# EAGLE design punch driver Rev A (EAGLE 6.6.0)

## Sheet 1 of 6
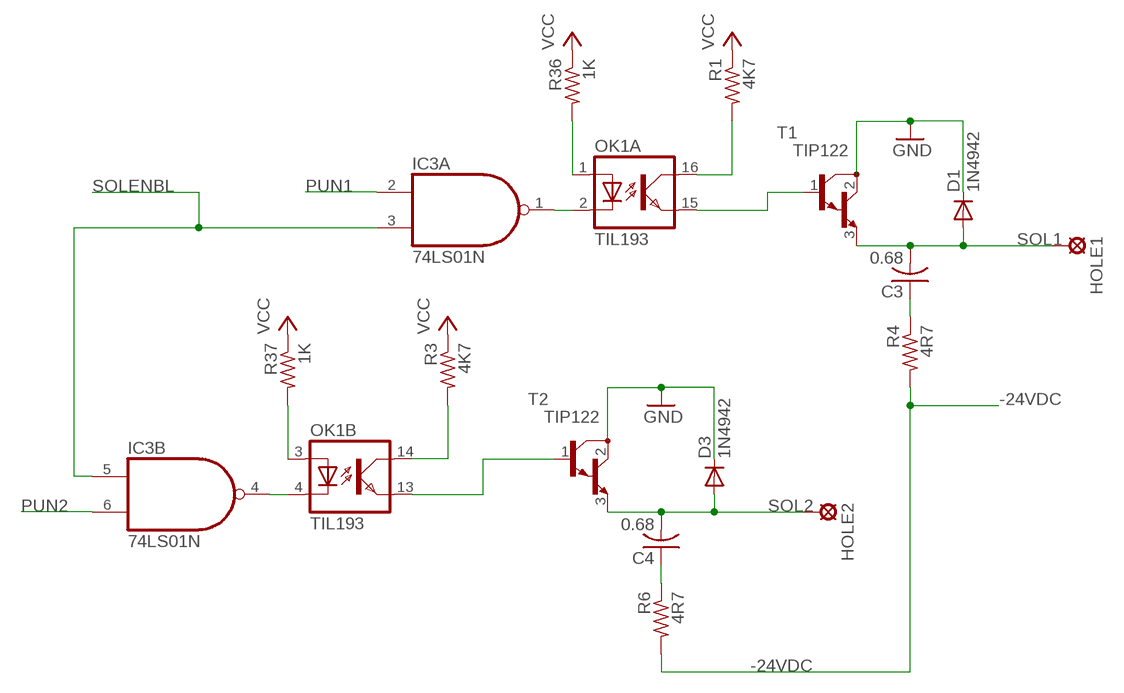
[diagram p0: schematic, sheet 1]

### Parts
C3  0.68  C-US075-042X103  [C075-042X103]
C4  0.68  C-US075-042X103  [C075-042X103]
D1  1N4942  [DO41-10]
D3  1N4942  [DO41-10]
HOLE1  SE13  [SE13]
HOLE2  SE13  [SE13]
IC3  74LS01N  [DIL14]
OK1  TIL193  [DIL16]
R1  4K7  R-US_0204/5  [0204/5]
R3  4K7  R-US_0204/5  [0204/5]
R4  4R7  R-US_0207/10  [0207/10]
R6  4R7  R-US_0207/10  [0207/10]
R36  1K  R-US_0204/5  [0204/5]
R37  1K  R-US_0204/5  [0204/5]
T1  TIP122  [TO220]
T2  TIP122  [TO220]

### Nets
-24VDC [power]: R4.2 R6.2 ; also sheet 2,3,4,5
GND [GND]: D1.C D3.C T1.2(C) T2.2(C) ; also sheet 2,3,4,5
N$3: OK1.15(A:EMIT) T1.1(B)
N$4: OK1.14(B:COL) R3.2
N$15 [power]: C3.1 R4.1
N$18 [power]: C4.1 R6.1
N$27: IC3.1(A:O) OK1.2(A:C)
N$28: IC3.4(B:O) OK1.4(B:C)
N$29: OK1.1(A:A) R36.2
N$30: OK1.3(B:A) R37.2
N$38: OK1.16(A:COL) R1.2
N$48: OK1.13(B:EMIT) T2.1(B)
PUN1: IC3.2(A:I0) ; also sheet 6
PUN2: IC3.6(B:I1) ; also sheet 6
SOL1 [power]: C3.2 D1.A HOLE1.MP T1.3(E)
SOL2 [power]: C4.2 D3.A HOLE2.MP T2.3(E)
SOLENBL: IC3.3(A:I1) IC3.5(B:I0) ; also sheet 2,3,4,5
VCC [power]: R1.1 R3.1 R36.1 R37.1 ; also sheet 2,3,4,5,6

## Sheet 2 of 6
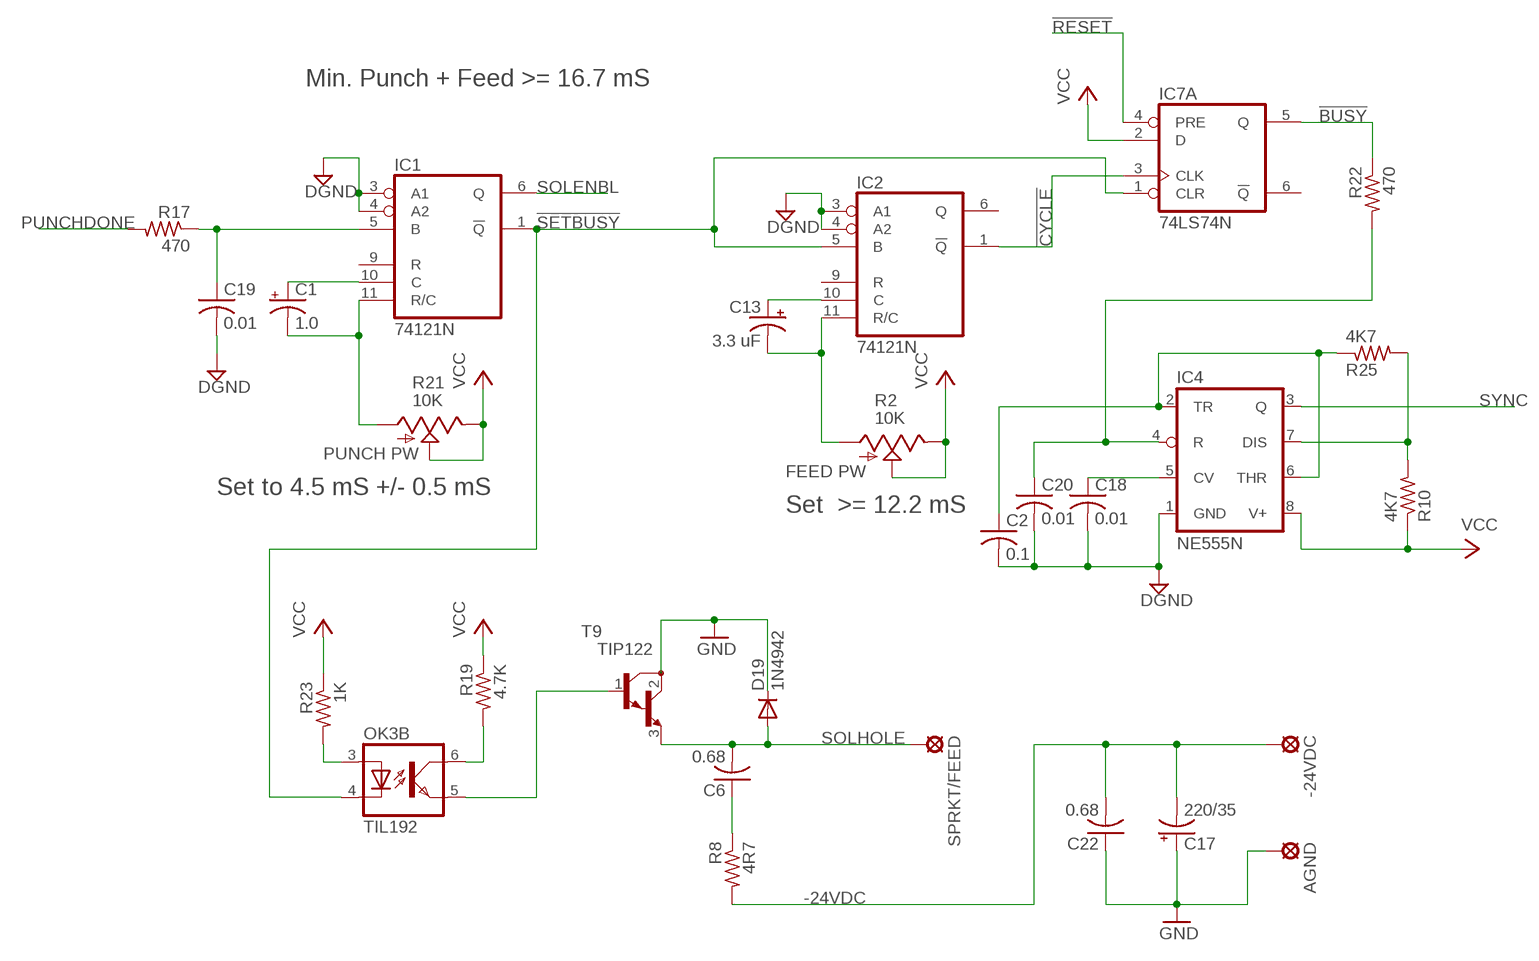
[diagram p1: schematic, sheet 2]

### Parts
-24VDC  SE13  [SE13]
AGND  SE13  [SE13]
C1  1.0  CPOL-USE5-10.5  [E5-10,5]
C2  0.1  C-US050-025X075  [C050-025X075]
C6  0.68  C-US075-042X103  [C075-042X103]
C13  3.3 uF  CPOL-USE5-10.5  [E5-10,5]
C17  220/35  CPOL-USE25-9AXIAL  [E25-9]
C18  0.01  C-US025-025X050  [C025-025X050]
C19  0.01  C-US025-025X050  [C025-025X050]
C20  0.01  C-US025-025X050  [C025-025X050]
C22  0.68  C-US075-042X103  [C075-042X103]
D19  1N4942  [DO41-10]
IC1  74121N  [DIL14]
IC2  74121N  [DIL14]
IC4  NE555N  [DIL08]
IC7  74LS74N  [DIL14]
OK3  TIL192  [DIL08]
R2  10K  TRIM_US-PTSPIN  [PT-SPIN]
R8  4R7  R-US_0207/10  [0207/10]
R10  4K7  R-US_0204/5  [0204/5]
R17  470  R-US_0204/5  [0204/5]
R19  4.7K  R-US_0204/5  [0204/5]
R21  10K  TRIM_US-PTSPIN  [PT-SPIN]
R22  470  R-US_0204/5  [0204/5]
R23  1K  R-US_0204/5  [0204/5]
R25  4K7  R-US_0204/5  [0204/5]
SPRKT/FEED  SE13  [SE13]
T9  TIP122  [TO220]

### Nets
!BUSY: IC7.5(A:Q) R22.1
!CYCLE: IC2.1(!Q) IC7.3(A:CLK)
!RESET: IC7.4(A:PRE) ; also sheet 6
!SETBUSY: IC1.1(!Q) IC2.5(B) IC7.1(A:CLR) OK3.4(B:C)
-24VDC [power]: -24VDC.MP C17.- C22.2 R8.2 ; also sheet 1,3,4,5
DGND [power]: C2.2 C18.2 C19.2 C20.2 IC1.3(A1) IC1.4(A2) IC2.3(A1) IC2.4(A2) IC4.1(GND) ; also sheet 6
GND [GND]: AGND.MP C17.+ C22.1 D19.C T9.2(C) ; also sheet 1,3,4,5
N$1: C1.+ IC1.10(C)
N$9: IC4.7(DIS) R10.2 R25.2
N$10: OK3.6(B:COL) R19.2
N$13: C19.1 IC1.5(B) R17.1
N$14: OK3.3(B:A) R23.2
N$16: C1.- IC1.11(R/C) R21.A
N$17: C2.1 IC4.2(TR) IC4.6(THR) R25.1
N$19: C20.1 IC4.4(R) R22.2
N$20 [power]: C6.1 R8.1
N$31: C13.+ IC2.10(C)
N$32: C13.- IC2.11(R/C) R2.A
N$49 [power]: OK3.5(B:EMIT) T9.1(B)
N$58: C18.1 IC4.5(CV)
PUNCHDONE: R17.2 ; also sheet 6
SOLENBL: IC1.6(Q) ; also sheet 1,3,4,5
SOLHOLE [power]: C6.2 D19.A SPRKT/FEED.MP T9.3(E)
SYNC: IC4.3(Q) ; also sheet 6
VCC [power]: IC4.8(V+) IC7.2(A:D) R2.E R2.S R10.1 R19.1 R21.E R21.S R23.1 ; also sheet 1,3,4,5,6
Unconnected: IC1.9(R) IC2.6(Q) IC2.9(R) IC7.6(A:!Q) OK3.1(A:A) OK3.2(A:C) OK3.7(A:EMIT) OK3.8(A:COL)

### Notes on the sheet
- Min. Punch + Feed >= 16.7 mS
- PUNCH PW
- FEED PW
- Set to 4.5 mS +/- 0.5 mS
- Set  >= 12.2 mS

## Sheet 3 of 6
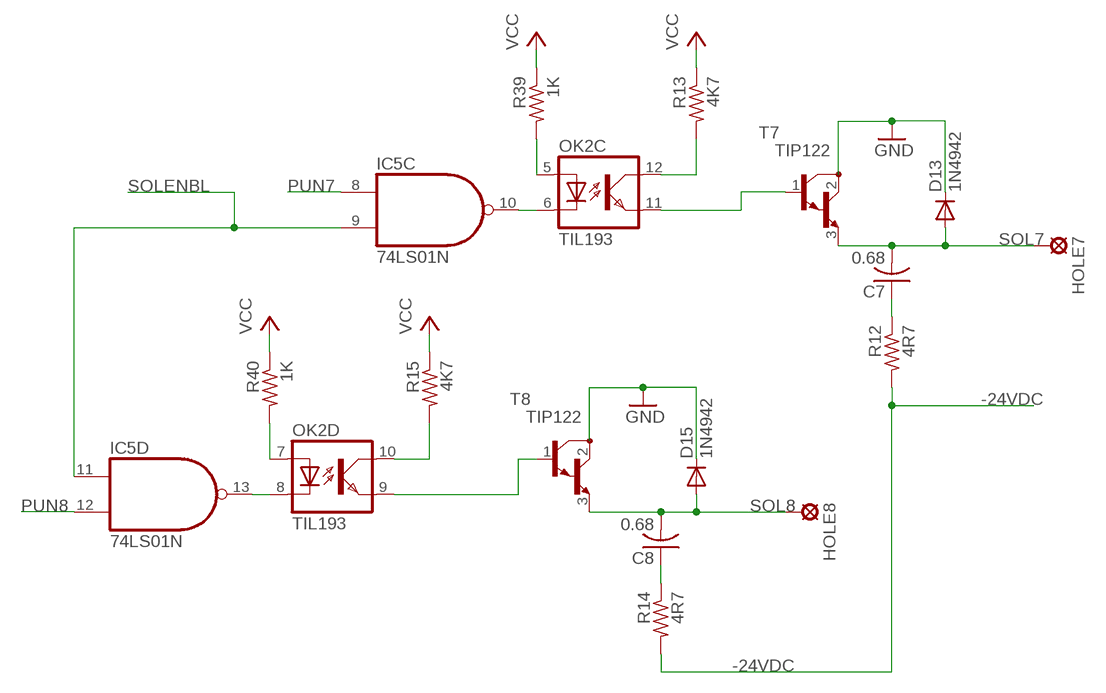
[diagram p2: schematic, sheet 3]

### Parts
C7  0.68  C-US075-042X103  [C075-042X103]
C8  0.68  C-US075-042X103  [C075-042X103]
D13  1N4942  [DO41-10]
D15  1N4942  [DO41-10]
HOLE7  SE13  [SE13]
HOLE8  SE13  [SE13]
IC5  74LS01N  [DIL14]
OK2  TIL193  [DIL16]
R12  4R7  R-US_0207/10  [0207/10]
R13  4K7  R-US_0204/5  [0204/5]
R14  4R7  R-US_0207/10  [0207/10]
R15  4K7  R-US_0204/5  [0204/5]
R39  1K  R-US_0204/5  [0204/5]
R40  1K  R-US_0204/5  [0204/5]
T7  TIP122  [TO220]
T8  TIP122  [TO220]

### Nets
-24VDC [power]: R12.2 R14.2 ; also sheet 1,2,4,5
GND [GND]: D13.C D15.C T7.2(C) T8.2(C) ; also sheet 1,2,4,5
N$11: OK2.12(C:COL) R13.2
N$12: OK2.10(D:COL) R15.2
N$21 [power]: C7.1 R12.1
N$22 [power]: C8.1 R14.1
N$40: IC5.13(D:O) OK2.8(D:C)
N$41: IC5.10(C:O) OK2.6(C:C)
N$42: OK2.7(D:A) R40.2
N$43: OK2.5(C:A) R39.2
N$51: OK2.11(C:EMIT) T7.1(B)
N$52: OK2.9(D:EMIT) T8.1(B)
PUN7: IC5.8(C:I0) ; also sheet 6
PUN8: IC5.12(D:I1) ; also sheet 6
SOL7 [power]: C7.2 D13.A HOLE7.MP T7.3(E)
SOL8 [power]: C8.2 D15.A HOLE8.MP T8.3(E)
SOLENBL: IC5.9(C:I1) IC5.11(D:I0) ; also sheet 1,2,4,5
VCC [power]: R13.1 R15.1 R39.1 R40.1 ; also sheet 1,2,4,5,6

## Sheet 4 of 6
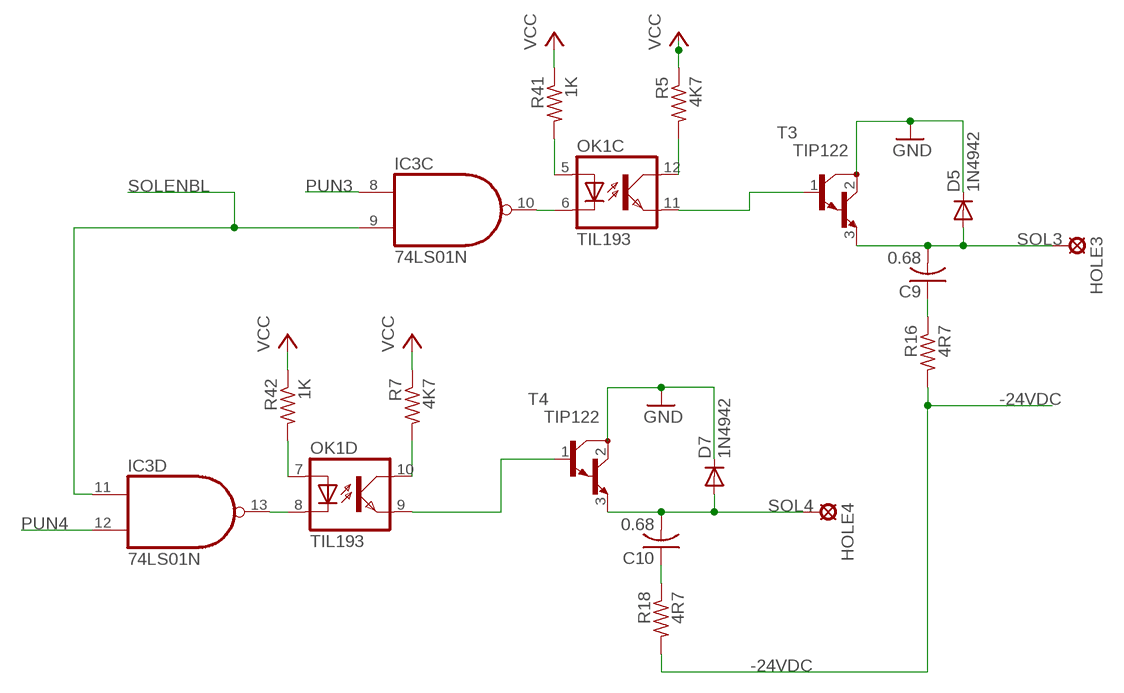
[diagram p3: schematic, sheet 4]

### Parts
C9  0.68  C-US075-042X103  [C075-042X103]
C10  0.68  C-US075-042X103  [C075-042X103]
D5  1N4942  [DO41-10]
D7  1N4942  [DO41-10]
HOLE3  SE13  [SE13]
HOLE4  SE13  [SE13]
R5  4K7  R-US_0204/5  [0204/5]
R7  4K7  R-US_0204/5  [0204/5]
R16  4R7  R-US_0207/10  [0207/10]
R18  4R7  R-US_0207/10  [0207/10]
R41  1K  R-US_0204/5  [0204/5]
R42  1K  R-US_0204/5  [0204/5]
T3  TIP122  [TO220]
T4  TIP122  [TO220]

### Nets
-24VDC [power]: R16.2 R18.2 ; also sheet 1,2,3,5
GND [GND]: D5.C D7.C T3.2(C) T4.2(C) ; also sheet 1,2,3,5
N$5: OK1.12(C:COL) R5.2
N$8: OK1.10(D:COL) R7.2
N$23 [power]: C9.1 R16.1
N$24 [power]: C10.1 R18.1
N$35: IC3.10(C:O) OK1.6(C:C)
N$36: IC3.13(D:O) OK1.8(D:C)
N$44: OK1.7(D:A) R42.2
N$45: OK1.5(C:A) R41.2
N$53: OK1.9(D:EMIT) T4.1(B)
N$54: OK1.11(C:EMIT) T3.1(B)
PUN3: IC3.8(C:I0) ; also sheet 6
PUN4: IC3.12(D:I1) ; also sheet 6
SOL3 [power]: C9.2 D5.A HOLE3.MP T3.3(E)
SOL4 [power]: C10.2 D7.A HOLE4.MP T4.3(E)
SOLENBL: IC3.9(C:I1) IC3.11(D:I0) ; also sheet 1,2,3,5
VCC [power]: R5.1 R7.1 R41.1 R42.1 ; also sheet 1,2,3,5,6

## Sheet 5 of 6
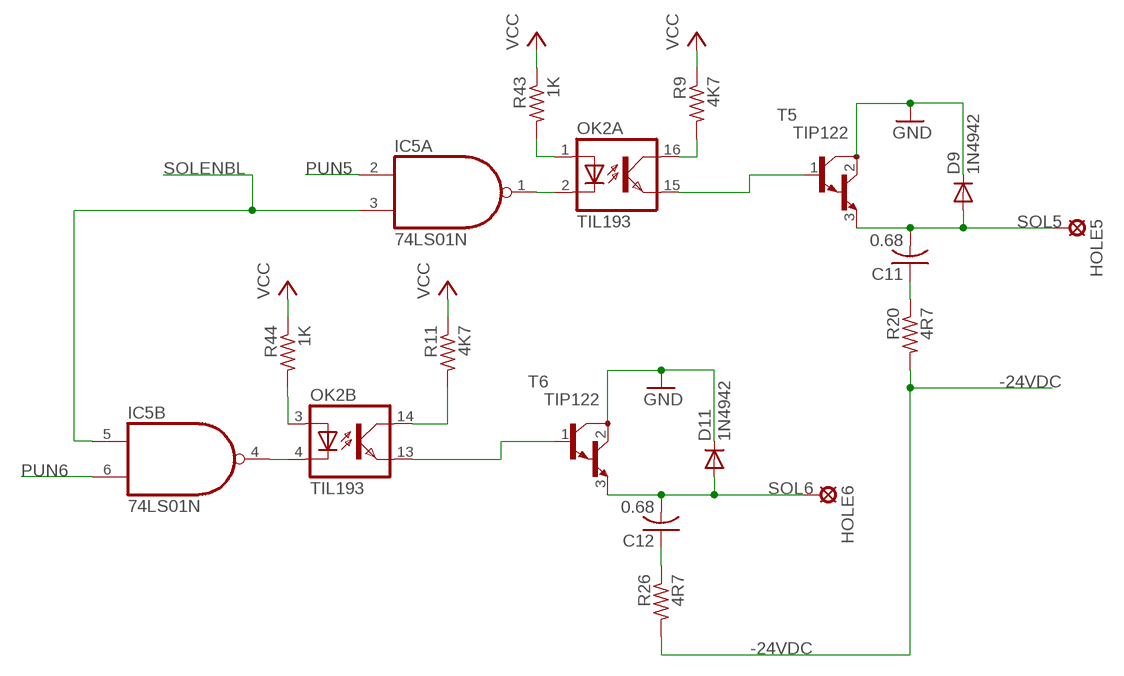
[diagram p4: schematic, sheet 5]

### Parts
C11  0.68  C-US075-042X103  [C075-042X103]
C12  0.68  C-US075-042X103  [C075-042X103]
D9  1N4942  [DO41-10]
D11  1N4942  [DO41-10]
HOLE5  SE13  [SE13]
HOLE6  SE13  [SE13]
R9  4K7  R-US_0204/5  [0204/5]
R11  4K7  R-US_0204/5  [0204/5]
R20  4R7  R-US_0207/10  [0207/10]
R26  4R7  R-US_0207/10  [0207/10]
R43  1K  R-US_0204/5  [0204/5]
R44  1K  R-US_0204/5  [0204/5]
T5  TIP122  [TO220]
T6  TIP122  [TO220]

### Nets
-24VDC [power]: R20.2 R26.2 ; also sheet 1,2,3,4
GND [GND]: D9.C D11.C T5.2(C) T6.2(C) ; also sheet 1,2,3,4
N$2: OK2.14(B:COL) R11.2
N$7: OK2.16(A:COL) R9.2
N$25 [power]: C11.1 R20.1
N$26 [power]: C12.1 R26.1
N$34: IC5.1(A:O) OK2.2(A:C)
N$37: IC5.4(B:O) OK2.4(B:C)
N$46: OK2.3(B:A) R44.2
N$47: OK2.1(A:A) R43.2
N$55: OK2.13(B:EMIT) T6.1(B)
N$56: OK2.15(A:EMIT) T5.1(B)
PUN5: IC5.2(A:I0) ; also sheet 6
PUN6: IC5.6(B:I1) ; also sheet 6
SOL5 [power]: C11.2 D9.A HOLE5.MP T5.3(E)
SOL6 [power]: C12.2 D11.A HOLE6.MP T6.3(E)
SOLENBL: IC5.3(A:I1) IC5.5(B:I0) ; also sheet 1,2,3,4
VCC [power]: R9.1 R11.1 R43.1 R44.1 ; also sheet 1,2,3,4,6

## Sheet 6 of 6
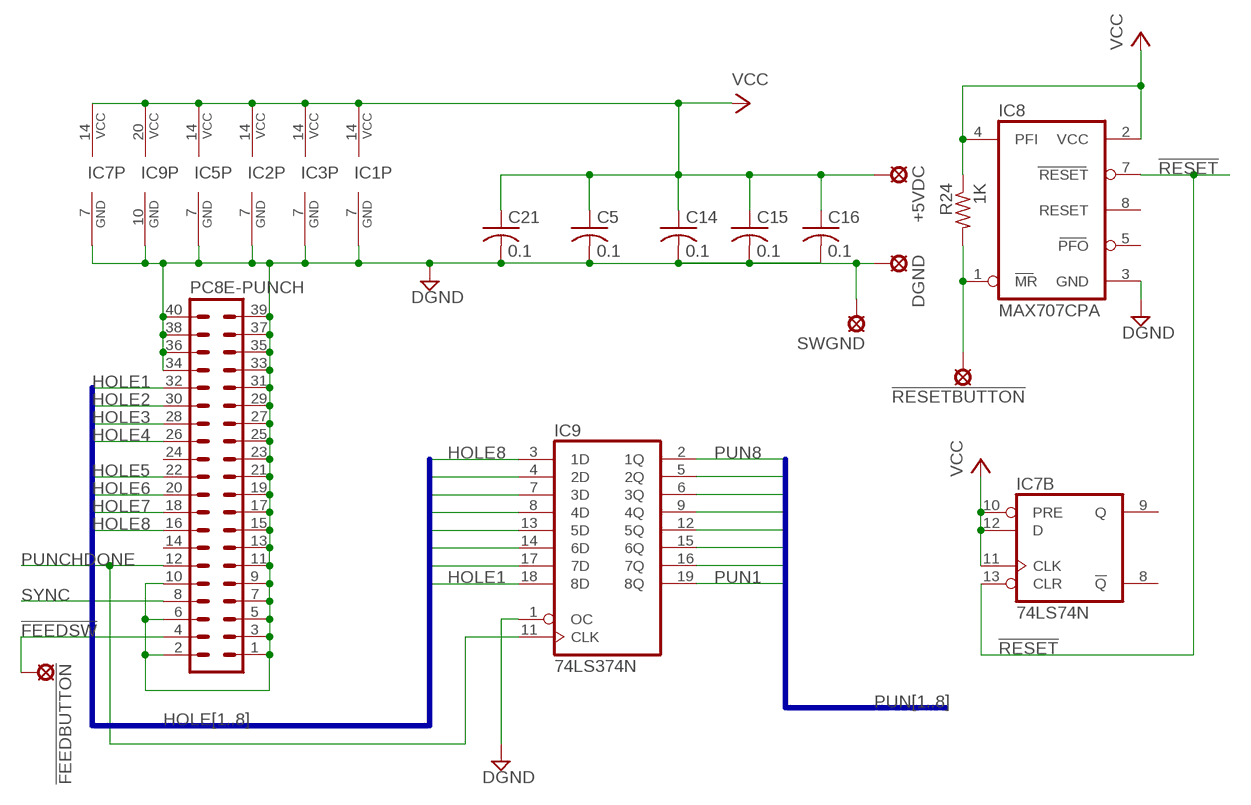
[diagram p5: schematic, sheet 6]

### Parts
!FEEDBUTTON  SE13  [SE13]
!RESETBUTTON  SE13  [SE13]
+5VDC  SE13  [SE13]
C5  0.1  C-US050-025X075  [C050-025X075]
C14  0.1  C-US050-025X075  [C050-025X075]
C15  0.1  C-US050-025X075  [C050-025X075]
C16  0.1  C-US050-025X075  [C050-025X075]
C21  0.1  C-US050-025X075  [C050-025X075]
DGND  SE13  [SE13]
IC8  MAX707CPA  [DIL08]
IC9  74LS374N  [DIL20]
PC8E-PUNCH  MA20-2  [MA20-2]
R24  1K  R-US_0204/5  [0204/5]
SWGND  SE13  [SE13]

### Nets
!FEEDSW: !FEEDBUTTON.MP PC8E-PUNCH.4
!RESET: IC7.13(B:CLR) IC8.7(RESET) ; also sheet 2
DGND [power]: C5.2 C14.2 C15.2 C16.2 C21.2 DGND.MP IC1.7(GND) IC2.7(GND) IC3.7(P:GND) IC5.7(P:GND) IC7.7(P:GND) IC8.3(GND) IC9.1(OC) IC9.10(GND) PC8E-PUNCH.1 PC8E-PUNCH.2 PC8E-PUNCH.3 PC8E-PUNCH.5 PC8E-PUNCH.6 PC8E-PUNCH.7 PC8E-PUNCH.9 PC8E-PUNCH.10 PC8E-PUNCH.11 PC8E-PUNCH.13 PC8E-PUNCH.15 PC8E-PUNCH.17 PC8E-PUNCH.19 PC8E-PUNCH.21 PC8E-PUNCH.23 PC8E-PUNCH.25 PC8E-PUNCH.27 PC8E-PUNCH.29 PC8E-PUNCH.31 PC8E-PUNCH.33 PC8E-PUNCH.34 PC8E-PUNCH.35 PC8E-PUNCH.36 PC8E-PUNCH.37 PC8E-PUNCH.38 PC8E-PUNCH.39 PC8E-PUNCH.40 SWGND.MP ; also sheet 2
HOLE1: IC9.18(8D) PC8E-PUNCH.32
HOLE2: IC9.17(7D) PC8E-PUNCH.30
HOLE3: IC9.14(6D) PC8E-PUNCH.28
HOLE4: IC9.13(5D) PC8E-PUNCH.26
HOLE5: IC9.8(4D) PC8E-PUNCH.22
HOLE6: IC9.7(3D) PC8E-PUNCH.20
HOLE7: IC9.4(2D) PC8E-PUNCH.18
HOLE8: IC9.3(1D) PC8E-PUNCH.16
N$39: !RESETBUTTON.MP IC8.1(MR) R24.2
PUN1: IC9.19(8Q) ; also sheet 1
PUN2: IC9.16(7Q) ; also sheet 1
PUN3: IC9.15(6Q) ; also sheet 4
PUN4: IC9.12(5Q) ; also sheet 4
PUN5: IC9.9(4Q) ; also sheet 5
PUN6: IC9.6(3Q) ; also sheet 5
PUN7: IC9.5(2Q) ; also sheet 3
PUN8: IC9.2(1Q) ; also sheet 3
PUNCHDONE: IC9.11(CLK) PC8E-PUNCH.12 ; also sheet 2
SYNC: PC8E-PUNCH.8 ; also sheet 2
VCC [power]: +5VDC.MP C5.1 C14.1 C15.1 C16.1 C21.1 IC1.14(VCC) IC2.14(VCC) IC3.14(P:VCC) IC5.14(P:VCC) IC7.10(B:PRE) IC7.11(B:CLK) IC7.12(B:D) IC7.14(P:VCC) IC8.2(VCC) IC8.4(PFI) IC9.20(VCC) R24.1 ; also sheet 1,2,3,4,5
Unconnected: IC7.8(B:!Q) IC7.9(B:Q) IC8.5(PFO) IC8.8(RESET) PC8E-PUNCH.14 PC8E-PUNCH.24

### Buses
PUN[1..8]
HOLE[1..8]

## Library data of the parts
!FEEDBUTTON !RESETBUTTON +5VDC -24VDC AGND DGND HOLE1-HOLE8 SPRKT/FEED SWGND = solpad:SE13: SOLDER PAD E1542, drill 1,3mm, distributor Buerklin, 07F815
C1 C13 C17 = rcl:CPOL-US: POLARIZED CAPACITOR, American symbol
C2-C12 C14-C16 C18-C22 = rcl:C-US: CAPACITOR, American symbol
D1 D3 D5 D7 D9 D11 D13 D15 D19 = diode:1N4942: DIODE 1.0 A, 200 V, 150 ns
IC1 IC2 = 74xx-us:74*121: Monostable MULTIVIBRATOR, schmitt trigger inputs
IC3 IC5 = 74xx-us:74*01: Quad 2-input NAND gate, open collector
IC4 = linear:*555: TIMER
IC7 = 74xx-us:74*74: Dual D type positive edge triggered FLIP FLOP, preset and clear
IC8 = maxim:MAX707CPA: WATCHDOG; MPN: MAX707CPA; OC_FARNELL: 1188005; OC_NEWARK: 34C4006
IC9 = 74xx-us:74*374: Octal D type transparent LATCH, edge triggered
OK1 OK2 = optocoupler:TIL193: TEXAS INSTRUMENTS OPTO COUPLER; OC_FARNELL: 1683365; OC_NEWARK: unknown
OK3 = optocoupler:TIL192: TEXAS INSTRUMENTS OPTO COUPLER; OC_FARNELL: 1683364; OC_NEWARK: unknown
PC8E-PUNCH = con-lstb:MA20-2: PIN HEADER; OC_FARNELL: unknown; OC_NEWARK: unknown
R1 R3-R20 R22-R26 R36 R37 R39-R44 = rcl:R-US_: RESISTOR, American symbol
R2 R21 = pot:TRIM_US-: POTENTIOMETER
T1-T9 = transistor:TIP122: NPN BIPOLAR DARLINGTON TRANSISTOR

## Net classes
1 power: width 0.762 mm, clearance 0.254 mm
2 GND: width 1.27 mm, clearance 0.254 mm

## Board
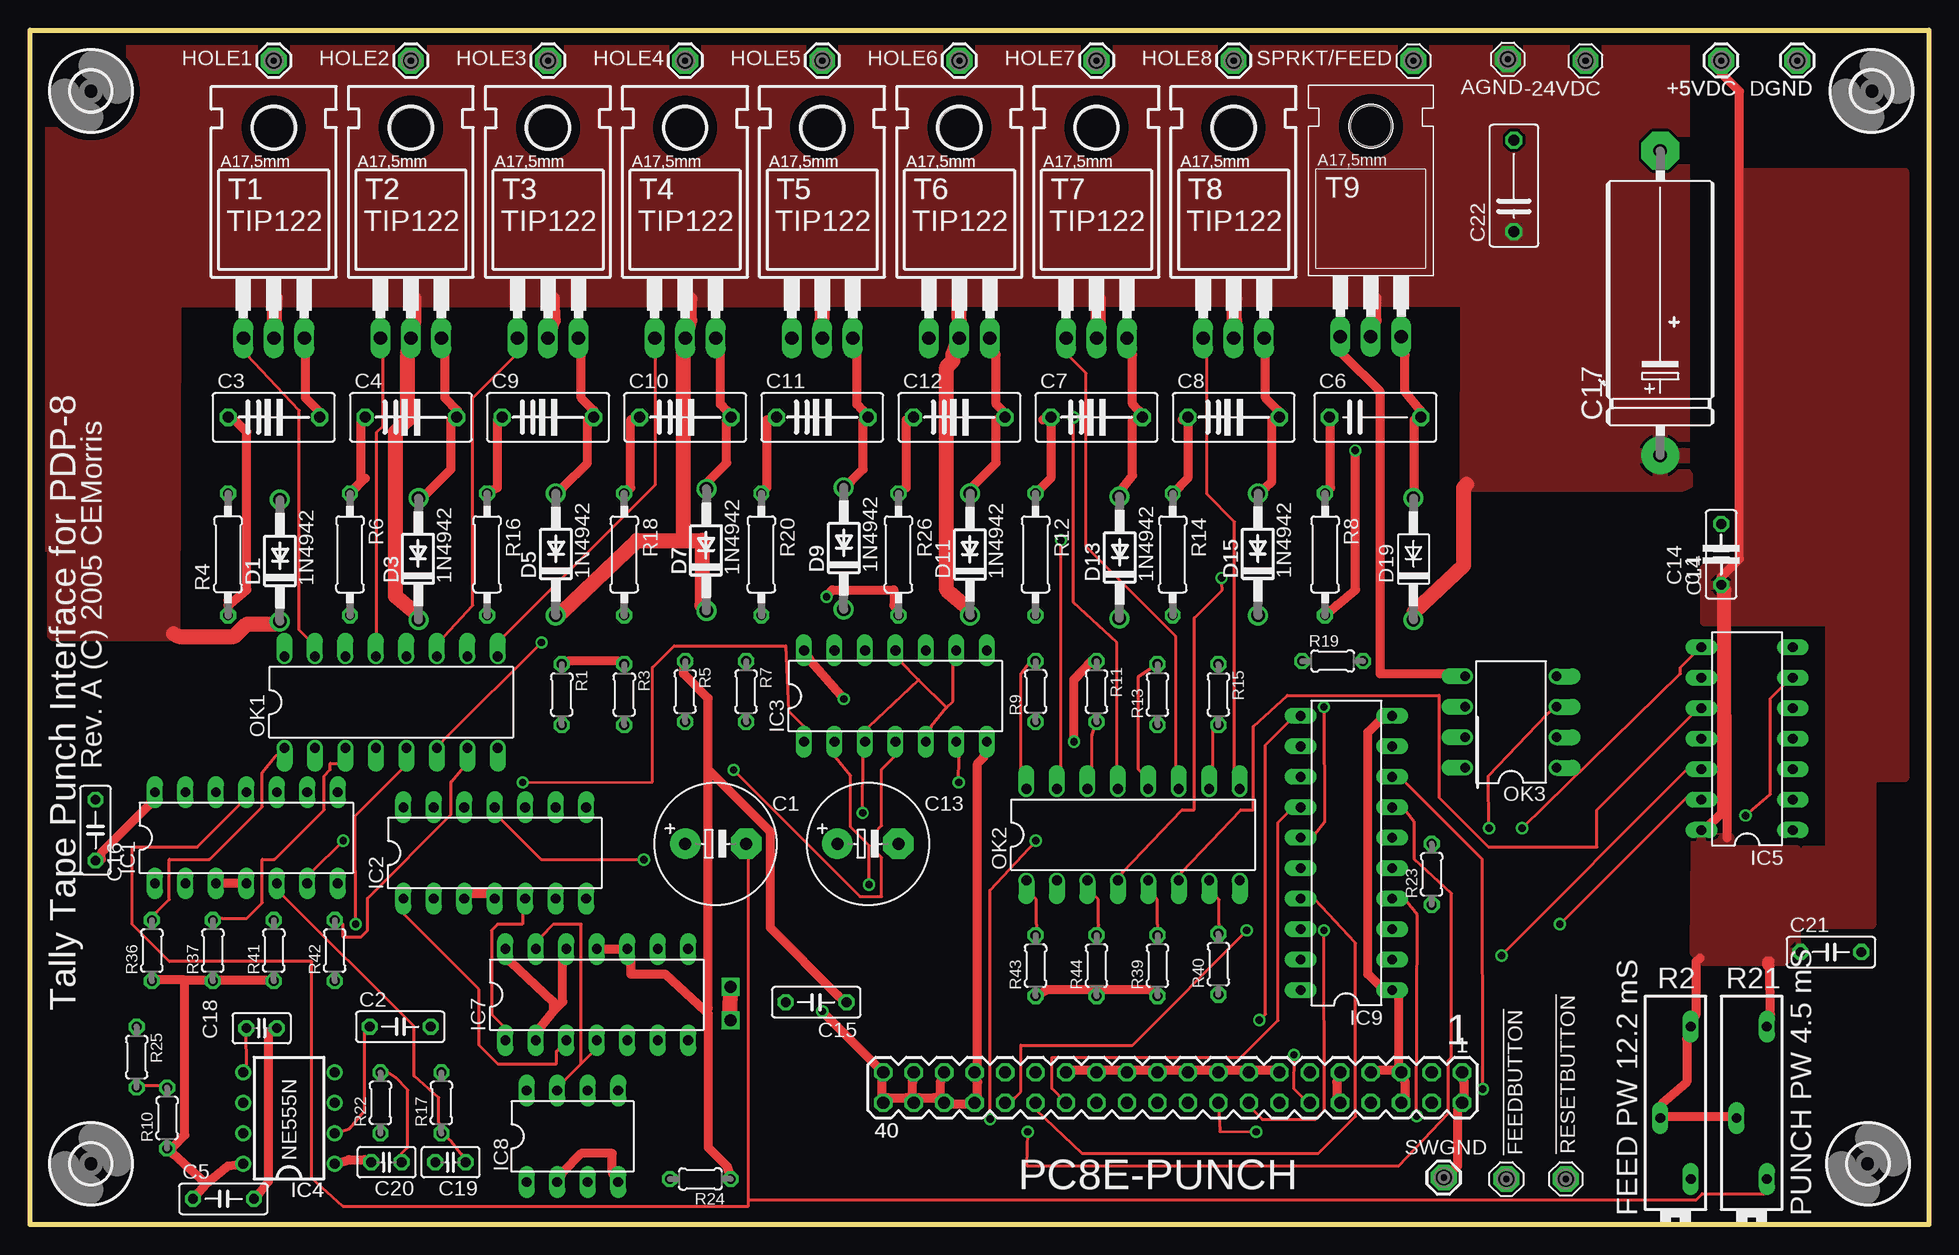
[diagram p6: board, top side]
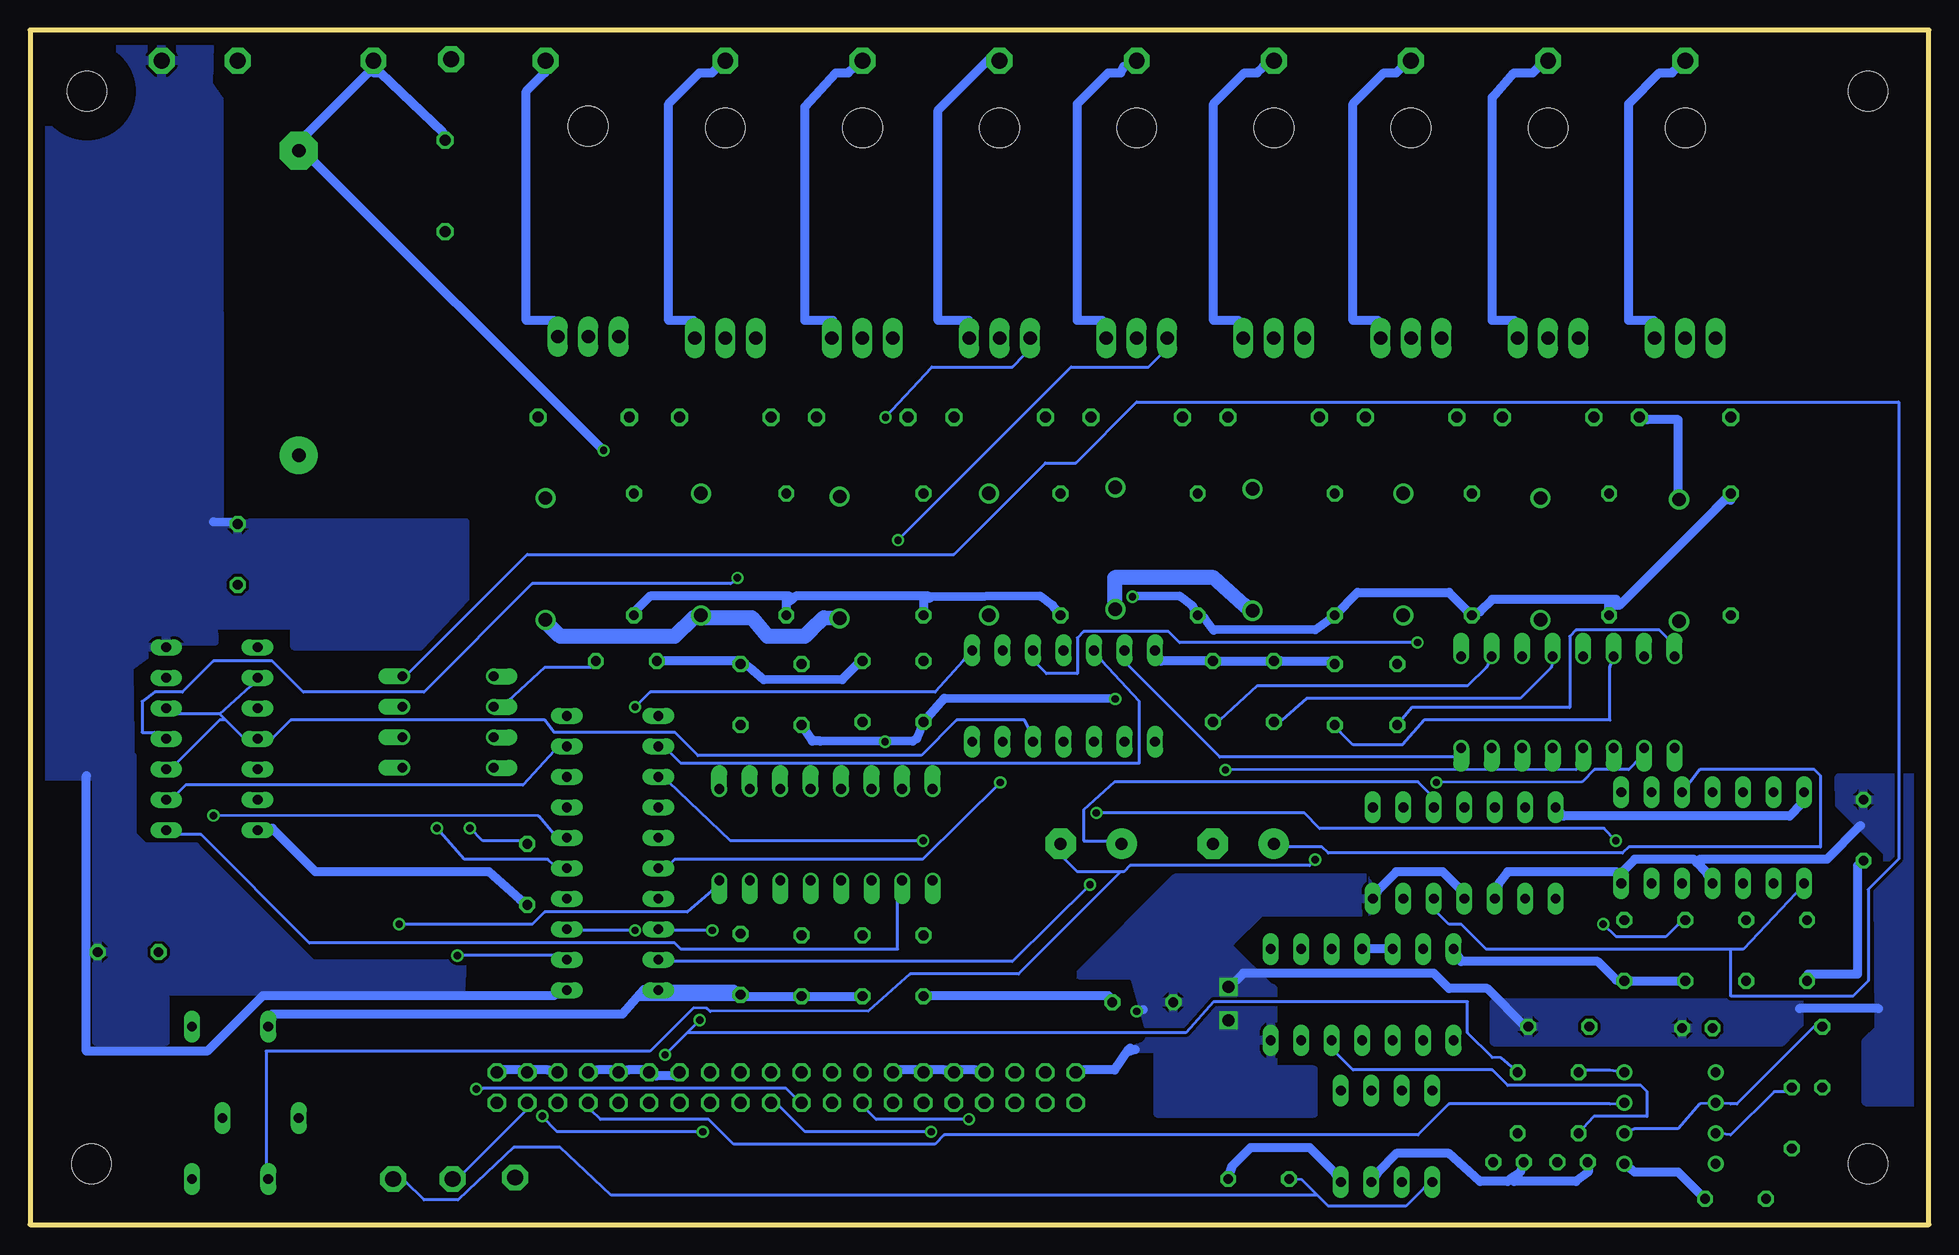
[diagram p7: board, bottom side, seen from below]

Size 158.29 x 99.6 mm. Coordinates in mm from the lower left corner, seen from the top.
Outline: 0,0 0,99.6 158.29,99.6 158.29,0 0,0
Copper layers (1*16): Top 0.035mm / dielectric 1.5mm / Bottom 0.035mm
Design rules "10mils *": minimum track width 10mil, minimum drill 24mil, track to track 10mil, track to pad 10mil, pad to pad 10mil, via to via 10mil, smd to smd 10mil, copper to edge 40mil, drill to drill 10mil, minimum pad ring 10mil, minimum via ring 8mil, stop-mask expansion 0mil, vias tented up to drill 0mil, thermal gap 10mil

### Footprints (pad centres in the part's own frame; a part is rotated, then mirrored left to right if it is on the bottom)
SE13 = drill 1.321 pad 2.159 octagon: MP 0,0
E5-10,5 = drill 1.016 pad 2.54: + -2.54,0 | drill 1.016 pad 2.54 octagon: - 2.54,0
C050-025X075 = drill 0.813 octagon: 1 -2.54,0; 2 2.54,0
C075-042X103 = drill 0.914 octagon: 1 -3.81,0; 2 3.81,0
E25-9 = drill 1.118 pad 3.15: + -12.7,0 | drill 1.118 pad 3.15 octagon: - 12.7,0
C025-025X050 = drill 0.813 octagon: 1 -1.27,0; 2 1.27,0
DO41-10 = drill 1.118: A 5.08,0; C -5.08,0
DIL14 = drill 0.813 long: 1 -7.62,-3.81; 2 -5.08,-3.81; 3 -2.54,-3.81; 4 0,-3.81; 5 2.54,-3.81; 6 5.08,-3.81; 7 7.62,-3.81; 8 7.62,3.81; 9 5.08,3.81; 10 2.54,3.81; 11 0,3.81; 12 -2.54,3.81; 13 -5.08,3.81; 14 -7.62,3.81
DIL08 = drill 0.813 pad 1.27: 1 -3.81,-3.81; 2 -1.27,-3.81; 3 1.27,-3.81; 4 3.81,-3.81; 5 3.81,3.81; 6 1.27,3.81; 7 -1.27,3.81; 8 -3.81,3.81
DIL08' = drill 0.813 long: 1 -3.81,-3.81; 2 -1.27,-3.81; 3 1.27,-3.81; 4 3.81,-3.81; 5 3.81,3.81; 6 1.27,3.81; 7 -1.27,3.81; 8 -3.81,3.81
DIL20 = drill 0.813 long: 1 -11.43,-3.81; 2 -8.89,-3.81; 3 -6.35,-3.81; 4 -3.81,-3.81; 5 -1.27,-3.81; 6 1.27,-3.81; 7 3.81,-3.81; 8 6.35,-3.81; 9 8.89,-3.81; 10 11.43,-3.81; 11 11.43,3.81; 12 8.89,3.81; 13 6.35,3.81; 14 3.81,3.81; 15 1.27,3.81; 16 -1.27,3.81; 17 -3.81,3.81; 18 -6.35,3.81; 19 -8.89,3.81; 20 -11.43,3.81
DIL16 = drill 0.813 offset: 1 -8.89,-3.81; 2 -6.35,-3.81; 3 -3.81,-3.81; 4 -1.27,-3.81; 5 1.27,-3.81; 6 3.81,-3.81; 7 6.35,-3.81; 8 8.89,-3.81; 9 8.89,3.81; 10 6.35,3.81; 11 3.81,3.81; 12 1.27,3.81; 13 -1.27,3.81; 14 -3.81,3.81; 15 -6.35,3.81; 16 -8.89,3.81
DIL08'' = drill 0.813 offset: 1 -3.81,-3.81; 2 -1.27,-3.81; 3 1.27,-3.81; 4 3.81,-3.81; 5 3.81,3.81; 6 1.27,3.81; 7 -1.27,3.81; 8 -3.81,3.81
MA20-2 = drill 1.016 octagon: 1 -24.13,-1.27; 2 -24.13,1.27; 3 -21.59,-1.27; 4 -21.59,1.27; 5 -19.05,-1.27; 6 -19.05,1.27; 7 -16.51,-1.27; 8 -16.51,1.27; 9 -13.97,-1.27; 10 -13.97,1.27; 11 -11.43,-1.27; 12 -11.43,1.27; 13 -8.89,-1.27; 14 -8.89,1.27; 15 -6.35,-1.27; 16 -6.35,1.27; 17 -3.81,-1.27; 18 -3.81,1.27; 19 -1.27,-1.27; 20 -1.27,1.27; 21 1.27,-1.27; 22 1.27,1.27; 23 3.81,-1.27; 24 3.81,1.27; 25 6.35,-1.27; 26 6.35,1.27; 27 8.89,-1.27; 28 8.89,1.27; 29 11.43,-1.27; 30 11.43,1.27; 31 13.97,-1.27; 32 13.97,1.27; 33 16.51,-1.27; 34 16.51,1.27; 35 19.05,-1.27; 36 19.05,1.27; 37 21.59,-1.27; 38 21.59,1.27; 39 24.13,-1.27; 40 24.13,1.27
0204/5 = drill 0.813 octagon: 1 -2.54,0; 2 2.54,0
PT-SPIN = drill 0.813 long: A -6.35,-1.27; E 6.35,-1.27; S -1.27,1.27
0207/10 = drill 0.813 octagon: 1 -5.08,0; 2 5.08,0
TO220 = drill 1.118 long: 1 -2.54,-6.35; 2 0,-6.35; 3 2.54,-6.35 | hole 3.302: 0,11.176
3,3 = hole 3.3: 0,0

### Placement (x,y rotation side)
!FEEDBUTTON  123.06,3.81 90 top
!RESETBUTTON  128.02,3.81 0 top
+5VDC  140.97,97.03 180 top
-24VDC  129.67,97.03 180 top
AGND  123.19,97.16 180 top
C1  57.15,31.75 0 top
C2  30.86,16.51 0 top
C3  20.32,67.31 0 top
C4  31.75,67.31 0 top
C5  16.13,2.16 0 top
C6  112.14,67.31 0 top
C7  88.9,67.31 0 top
C8  100.33,67.31 0 top
C9  43.18,67.31 0 top
C10  54.61,67.31 0 top
C11  66.04,67.31 0 top
C12  77.47,67.31 0 top
C13  69.85,31.75 0 top
C14  140.97,55.88 90 top
C15  65.53,18.54 180 top
C16  5.46,32.89 90 top
C17  135.89,76.83 90 top
C18  19.3,16.38 0 top
C19  35.05,5.21 180 top
C20  29.72,5.21 180 top
C21  150.11,22.73 0 top
C22  123.7,86.61 90 top
D1  20.83,55.37 90 top
D3  32.38,55.5 90 top
D5  43.81,55.88 90 top
D7  56.39,56.26 90 top
D9  67.82,56.39 90 top
D11  78.36,55.88 90 top
D13  90.81,55.63 90 top
D15  102.36,55.88 90 top
D19  115.32,55.5 90 top
DGND  147.32,97.03 180 top
HOLE1  20.32,97.03 90 top
HOLE2  31.75,97.03 90 top
HOLE3  43.18,97.03 90 top
HOLE4  54.61,97.03 90 top
HOLE5  66.04,97.03 90 top
HOLE6  77.47,97.03 90 top
HOLE7  88.9,97.03 90 top
HOLE8  100.33,97.03 90 top
IC1  18.03,32.26 0 top
IC2  38.73,30.99 0 top
IC3  72.14,44.07 0 top
IC4  21.59,8.89 90 top
IC5  143.13,40.51 90 top
IC7  47.24,19.18 0 top
IC8  MAX707CPA  [DIL08']  45.21,7.37 0 top
IC9  109.73,30.99 90 top
OK1  30.1,43.56 0 top
OK2  91.95,32.51 0 top
OK3  TIL192  [DIL08'']  123.44,41.91 90 top
PC8E-PUNCH  95.25,11.43 180 top
R1  44.32,44.2 270 top
R2  137.16,10.16 90 top
R3  49.53,44.2 270 top
R4  16.51,55.88 90 top
R5  54.61,44.45 270 top
R6  26.67,55.88 270 top
R7  59.69,44.45 270 top
R8  107.95,55.88 270 top
R9  83.82,44.45 90 top
R10  11.43,8.89 90 top
R11  88.9,44.45 270 top
R12  83.82,55.88 270 top
R13  93.98,44.2 90 top
R14  95.25,55.88 270 top
R15  99.06,44.2 270 top
R16  38.1,55.88 270 top
R17  34.29,10.16 90 top
R18  49.53,55.88 270 top
R19  108.58,46.99 0 top
R20  60.96,55.88 270 top
R21  143.51,10.16 90 top
R22  29.21,10.16 90 top
R23  116.84,29.21 90 top
R24  55.88,3.81 180 top
R25  8.89,13.97 270 top
R26  72.39,55.88 270 top
R36  10.16,22.86 90 top
R37  15.24,22.86 90 top
R39  93.98,21.59 90 top
R40  99.06,21.72 90 top
R41  20.32,22.86 90 top
R42  25.4,22.86 90 top
R43  83.82,21.59 90 top
R44  88.9,21.59 90 top
SPRKT/FEED  115.32,97.03 90 top
SWGND  117.86,3.94 0 top
T1  20.32,80.26 0 top
T2  31.75,80.26 0 top
T3  43.18,80.26 0 top
T4  54.61,80.26 0 top
T5  66.04,80.26 0 top
T6  77.47,80.26 0 top
T7  88.9,80.26 0 top
T8  100.33,80.26 0 top
T9  111.76,80.39 0 top
U$1  [3,3]  5.08,94.49 0 top
U$2  [3,3]  153.54,94.49 0 top
U$3  [3,3]  153.16,5.08 0 top
U$4  [3,3]  5.08,5.08 0 top

### Tracks (layer width: path | path; a pad name or v marks a point on that pad's centre or on a via)
!BUSY
  Bottom 0.254: IC7.5 49.56,14.46 48.01,12.91 36.4,12.91 35.1,11.61 24.01,11.61 23.49,11.1 23.49,9.03 27.94,9.03 R22.1
!CYCLE
  Top 0.254: IC2.1 30.98,26.07 37.43,19.62 37.43,14.97 38.98,13.42 43.88,13.42 43.88,14.46 IC7.3
!FEEDSW
  Bottom 0.254: PC8E-PUNCH.4 116.93,9.55 122.09,4.39 122.61,4.39 !FEEDBUTTON.MP
!RESET
  Top 0.254: 45.95,13.42 46.98,14.46 IC7.4 | 45.95,13.42 44.4,11.88 IC8.7 | 45.95,13.42 45.95,25.04 43.62,25.04 42.59,24.01 IC7.13
!SETBUSY
  Top 0.254: IC7.1 39.49,16.52 38.46,17.55 38.46,24.52 38.98,25.04 41.04,25.04 41.04,26.07 IC2.5
  Bottom 0.254: 16.51,22.97 15.49,22.97 11.1,27.62 IC1.1 | 16.51,22.97 36.91,22.97 38.98,25.04 40.01,25.04 41.04,26.07 IC2.5 | 16.51,22.97 16.51,19.05 6.35,19.05 5.08,20.32 5.08,27.94 2.54,30.48 2.54,68.58 66.04,68.58 71.12,63.5 73.66,63.5 81.28,55.88 116.84,55.88 127,45.72 OK3.4
-24VDC  (via drill 0.61)
  Top 0.762: v110.47,64.55 110.48,52.92 108.93,51.62 R8.2 | v66.39,52.35 66.86,52.92 72.02,52.92 72.02,51.62 R26.2
  Bottom 0.762: 17.77,59.67 17.04,60.4 16.52,60.4 | 17.77,59.67 25.81,51.63 | 25.81,51.63 26.07,51.62 | 26.67,52.14 26.07,52.14 25.81,51.63 | 26.67,52.14 36.4,52.14 37.43,51.11 R16.2 40.01,52.7 47.62,52.7 R18.2 51.15,49.61 59.63,49.56 60.4,50.59 R20.2 61.44,51.62 62.47,52.4 v66.39,52.35 | C22.2 123.9,91.12 129.06,96.02 129.58,96.02 -24VDC.MP 130.1,96.02 135.52,90.6 C17.- 135,89.05 v110.47,64.55 | 94.73,52.14 94.48,52.4 83.82,52.4 | 94.73,52.14 95.12,51.88 95.25,52.07 R14.2 | 83.82,52.4 83.38,52.4 83.32,52.21 83.18,52.35 74.08,52.4 73.05,51.62 R26.2 | 94.73,52.14 94.99,52.4 106.61,52.4 107.9,51.11 R8.2 | R4.2 17.78,59.69 17.77,59.67 | R6.2 26.67,52.14 | 83.82,52.4 R12.2
DGND  (via drill 0.61, 1)
  Top 0.762: PC8E-PUNCH.1 119.51,11.88 119.51,10.58 PC8E-PUNCH.2 119,9.55 119,4.91 118.48,4.39 SWGND.MP | 114.09,12.91 114.09,19.1 IC9.1 112.54,19.88 111.51,20.91 111.51,41.04 112.54,42.07 IC9.10 | PC8E-PUNCH.6 114.61,10.58 114.61,11.88 PC8E-PUNCH.5 114.09,12.91 | 114.09,12.91 112.54,12.91 PC8E-PUNCH.7 | IC4.1 26.59,5.42 27.88,5.42 C20.2 | IC2.3 36.4,27.62 38.46,27.62 IC2.4 | IC1.4 IC1.3 | C5.2 19.1,2.58 19.88,3.61 19.88,16 C18.2 | PC8E-PUNCH.36 75.89,10.58 75.89,11.88 PC8E-PUNCH.35 | PC8E-PUNCH.38 73.57,10.58 73.57,11.88 PC8E-PUNCH.37 | PC8E-PUNCH.38 73.05,10.58 71.5,10.58 PC8E-PUNCH.40 70.99,10.58 70.99,11.88 PC8E-PUNCH.39 v66.04,17.78 | PC8E-PUNCH.36 75.38,10.58 74.08,10.58 PC8E-PUNCH.38 | PC8E-PUNCH.10 108.93,10.58 108.93,11.88 PC8E-PUNCH.9 | PC8E-PUNCH.13 103.51,12.91 101.96,12.91 PC8E-PUNCH.15 100.93,12.91 99.38,12.91 PC8E-PUNCH.17 98.6,12.91 97.06,12.91 PC8E-PUNCH.19 96.02,12.91 94.48,12.91 PC8E-PUNCH.21 93.44,12.91 91.9,12.91 PC8E-PUNCH.23 91.12,12.91 89.57,12.91 PC8E-PUNCH.25 88.54,12.91 86.99,12.91 PC8E-PUNCH.27 | IC3.7 79.5,38.98 78.99,38.46 78.99,12.91 PC8E-PUNCH.33 78.99,11.88 78.99,10.58 PC8E-PUNCH.34 77.96,10.07 76.41,10.07 PC8E-PUNCH.36 | 58.34,17.55 58.08,17.55 v58.38,17.05
  Top 1.27: 58.34,17.29 58.34,17.55 v58.38,19.82
  Bottom 0.762: PC8E-PUNCH.1 119,12.91 117.45,12.91 PC8E-PUNCH.3 116.42,12.91 115.12,12.91 PC8E-PUNCH.5 | 143,58.59 141.48,58.55 C14.2 | 153.59,37.43 153.59,14.46 143.52,14.46 138.88,19.1 114.61,19.1 IC9.1 | C5.2 20.91,4.39 24.52,4.39 IC4.1 | 34.85,3.87 34.07,4.39 C19.2 | 34.85,3.87 35.1,3.61 37.43,3.61 40.01,5.94 44.4,5.94 45.95,4.39 IC8.3 | C20.2 28.4,4.39 29.43,3.61 34.59,3.61 34.85,3.87 | 4.19,18.03 10.79,18.03 | 19.36,30.2 18.58,29.43 IC1.4 | 19.36,30.2 19.62,30.46 24.52,30.46 25.55,29.43 IC1.7 26.07,29.43 35.1,29.43 35.88,28.4 IC2.3 | 5.71,33.27 8.52,30.46 19.1,30.46 19.36,30.2 | PC8E-PUNCH.33 79.5,12.91 81.05,12.91 PC8E-PUNCH.31 82.08,12.91 83.38,12.91 PC8E-PUNCH.29 84.41,12.91 85.96,12.91 PC8E-PUNCH.27 | PC8E-PUNCH.13 104.54,12.39 106.09,12.39 PC8E-PUNCH.11 107.12,12.91 108.42,12.91 PC8E-PUNCH.9 109.45,12.91 111,12.91 PC8E-PUNCH.7 | 66.73,14.6 67.89,12.91 70.47,12.91 PC8E-PUNCH.39 | 66.73,14.6 66.6,14.71 | IC2.4 38.98,27.88 40.53,29.43 44.4,29.43 45.95,27.88 IC2.7 | 66.17,14.61 66.6,14.46 66.73,14.6 | v66.04,17.78 65.48,17.94 | C2.2 33.66,16.51 36.83,19.68 40.01,19.68 41.27,20.95 57.15,20.95 58.42,19.68
  pour Bottom: 143.3,98.5 157.4,98.5 157.25,39 157.35,37.4 149.9,37.4 150,46.5 147.25,48.5 147.45,48.5 147.6,48.65 142.9,48.65 143,50 136.25,50 136.25,48.25 125.75,48.25 122,52.25 122,58.5 142.48,58.55 142.5,93.75 143.4,95.05
  pour Bottom: 47,28.9 62.8,28.9 70.85,20.85 66.05,20.85 66.2,20.5 64.9,15.88 arc90 66.1,14.7 64.4,14.7 arc90 64.3,14.6 64.3,9.3 51.3,9.3 51.3,12.9 54.7,12.9 54.7,19.7 54.9,19.7 58.3,23.1 58.3,23.5 55.7,26.1 46.8,26.1 46.8,28.5
  pour Bottom: 122.23,21.75 134.75,21.75 144.5,31.5 148.75,31.5 149.75,32.5 149.75,39 152.75,39 152.75,15.25 147,15.25 147,19.5 122.36,19.5
  pour Bottom: 0.75,37.25 7.5,37.25 7.46,35.02 3.46,31.02 3.5,29 4.25,28.25 4.19,16.28 5.25,15.25 5.25,10.25 0.75,10.25
  pour Bottom: 11,18.5 36.25,18.5 36.25,15.25 12.25,15.25 10.79,16.78 10.79,18.53
GND
  Top 1.27: 54.47,57.05 56.01,57.05 56.01,51.62 D7.C | 54.47,57.05 50.59,57.05 44.4,51.11 D5.C | D1.C 20.39,50.08 18.07,50.08 17.04,49.04 12.39,49.04 11.94,49.28 | T1.2 20.39,75.38 20.45,77.22 | 32,77.22 32.01,75.38 T2.2 31.49,72.53 31.49,67.11 30.46,66.08 30.46,52.4 32.01,51.11 D3.C | T3.2 43.62,75.38 43.56,77.22 | 54.98,77.18 54.98,75.38 T4.2 54.47,72.53 54.47,57.05 | T5.2 66.08,77.15 | 77.44,77.15 T6.2 76.92,72.53 76.92,72.02 76.41,71.5 76.41,52.92 77.96,51.62 D11.C | T7.2 89.05,75.38 89.05,77.18 | T8.2 100.41,75.38 100.41,77.18 | T9.2 112.03,75.38 112.03,77.18 | D19.C 115.39,51.11 119.51,54.98 119.51,61.44 119.76,61.72
  Bottom 1.27: D9.C 67.89,51.89 67.89,53.95 59.63,53.95 57.05,51.62 D7.C | D13.C 92.14,50.59 93.17,49.56 93.21,49.56 93.72,49.04 96.82,49.04 98.11,50.59 101.96,50.59 D15.C 102.99,50.59 104.54,49.04 114.09,49.04 115.12,50.08 D19.C
  pour Top: 0.5,99 0.5,56.75 2,56.75 2,49.25 11.94,49.28 12.02,77.08 119.82,77.15 119.76,61.72 137.75,61.75 138.25,62 137.75,62.75 137.75,98.75 0.75,98.75
HOLE1  (via drill 0.61)
  Top 0.254: v101.42,24.53 91.9,14.97 82.6,14.97 82.6,11.1 82.08,10.58 PC8E-PUNCH.32
  Bottom 0.254: v101.42,24.53 105.06,24.52 IC9.18
HOLE2
  Top 0.254: IC9.17 107.12,27.1 110.48,23.49 110.48,9.03 107.38,5.94 87.7,5.94 83.89,9.55 PC8E-PUNCH.30
HOLE3
  Top 0.254: PC8E-PUNCH.28 85.18,11.36 85.18,13.94 100.93,13.94 104.03,17.04 104.03,33.56 105.06,34.59 IC9.14
HOLE4  (via drill 0.61)
  Top 0.254: v83.84,32.01 80.02,27.88 v80.03,8.8
  Bottom 0.254: v83.84,32.01 99.9,32.01 105.06,36.91 IC9.13 | v80.03,8.8 87.77,8.78 88.54,9.55 PC8E-PUNCH.26
HOLE5  (via drill 0.61)
  Top 0.254: v121.09,11.31 121.06,30.46 114.61,36.91 IC9.8
  Bottom 0.254: v121.09,11.31 120.55,11.36 95.25,11.36 94.48,10.58 PC8E-PUNCH.22
HOLE6  (via drill 0.61)
  Top 0.254: v83.17,7.75 83.12,4.91 114.09,4.91 118.22,9.29 118.22,13.68 118.48,13.94 118.48,27.62 115.39,30.46 115.39,33.56 114.61,34.59 IC9.7
  Bottom 0.254: v83.17,7.75 93.71,7.75 96.02,10.07 PC8E-PUNCH.20
HOLE7  (via drill 0.61)
  Top 0.254: v115.58,9.05 115.64,25.82 114.61,27.1 IC9.4 | v102.21,7.75 99.18,7.77 PC8E-PUNCH.18
  Bottom 0.254: v115.58,9.05 114.35,7.75 v102.21,7.75
HOLE8  (via drill 0.61)
  Top 0.254: v107.85,24.53 107.9,9.55 107.13,8.78 102.72,8.78 101.96,9.55 PC8E-PUNCH.16
  Bottom 0.254: v107.85,24.53 112.54,24.52 IC9.3
N$1
  Bottom 0.254: IC1.10 19.88,36.91 19.1,37.95 9.55,37.95 9.03,37.43 9.03,31.49 25.04,31.49 25.55,30.98 50.08,30.98 50.59,31.49 53.95,31.49 C1.+
N$2
  Top 0.254: OK2.14 88.54,37.43 88.54,40.8 R11.2
N$3
  Top 0.254: OK1.15 23.49,48.53 22.46,49.56 22.46,67.89 18.07,72.53 T1.1
N$4
  Bottom 0.254: OK1.14 26.59,46.46 26.59,42.07 42.07,42.07 43.88,40.01 48.01,40.01 49.04,41.04 R3.2
N$5
  Bottom 0.254: OK1.12 31.49,46.46 34.07,43.88 51.89,43.88 53.95,42.07 R5.2
N$7
  Top 0.254: OK2.16 83.12,37.43 82.6,37.95 82.6,45.95 83.38,46.98 R9.2
N$8
  Bottom 0.254: OK1.10 36.91,46.46 38.46,44.92 56.01,44.92 59.11,42.07 R7.2
N$9
  Top 0.254: R10.2 11.1,11.61 9.55,11.61 R25.2
  Bottom 0.254: IC4.7 16.52,7.49 12.91,11.1 11.88,11.1 R10.2
N$10
  Bottom 0.254: OK3.6 118.48,43.62 115.39,46.46 111.51,46.46 R19.2
N$11
  Top 0.254: OK2.12 92.93,37.43 92.41,37.95 92.38,45.68 R13.2
N$12
  Top 0.254: OK2.10 98.6,37.43 98.6,41.82 R15.2
N$13
  Top 0.254: IC1.5 20.91,27.62 32.01,16.52 32.01,12.39 34.07,10.58 34.07,8.52 R17.1 35.1,6.97 35.88,5.94 C19.1
N$14  (via drill 0.61)
  Top 0.254: v121.62,33.06 121.58,37.43 126.48,42.59 OK3.3
  Bottom 0.254: v121.62,33.06 120.55,32.01 117.45,32.01 R23.2
N$15
  Top 0.762: 16.52,51.62 16.73,51.8 | 16.73,51.8 18.07,52.92 18.07,66.08 17.04,67.11 C3.1 | R4.1 16.51,52.07 16.73,51.8
N$16
  Top 0.254: 59.89,2.06 59.89,30.98 C1.- | 59.89,2.06 59.89,1.55 26.07,1.55 23.49,3.87 23.49,21.94 11.61,21.94 8.52,25.04 8.52,31.49 13.94,31.49 17.55,35.1 IC1.11 | 59.89,2.06 138.88,2.06 139.39,2.58 144.55,2.58 R21.A
N$17
  Top 0.254: IC4.2 26.59,8 27.88,9.55 27.88,16 C2.1
  Bottom 0.254: IC4.2 24.52,8 20.91,8 19.1,10.07 IC4.6 16.52,10.07 16,10.07 9.55,16.52 R25.1
N$18
  Top 0.762: 27.1,61.44 27.62,61.95 27.62,62.23 | 27.62,62.23 27.62,67.11 C4.1 | R6.1 27.94,62.23 27.62,62.23
N$19
  Top 0.254: C20.1 30.98,5.94 31.49,6.45 31.49,11.24 30.46,12.27 29.84,12.7 R22.2
  Bottom 0.254: IC4.4 26.59,12.91 28.57,12.91 R22.2
N$20
  Top 0.762: C6.1 108.42,67.11 108.42,61.44 R8.1
N$21
  Top 0.762: 84.41,67.11 C7.1 85.09,62.23 R12.1
N$22
  Top 0.762: 96.02,67.11 C8.1 96.52,62.23 R14.1
N$23
  Top 0.762: C9.1 38.98,67.11 38.98,61.44 R16.1
N$24
  Top 0.762: C10.1 50.08,67.11 50.08,61.44 R18.1
N$25
  Top 0.762: C11.1 61.44,67.11 61.44,61.44 R20.1
N$26
  Top 0.762: C12.1 73.05,67.11 73.05,61.44 R26.1
N$27  (via drill 0.61)
  Top 0.254: v41.06,36.87 51.89,36.91 51.89,46.46 53.69,48.27 62.99,48.27 63.25,42.84 64.53,41.56 IC3.1
  Bottom 0.254: v41.06,36.87 28.91,36.91 27.88,37.95 25.04,37.95 24.01,38.98 OK1.2
N$28  (via drill 0.61)
  Top 0.254: v58.64,37.92 69.18,27.36 70.99,27.36 70.99,30.61 70.48,31.11 70.48,32.77 70.99,33.27 70.99,37.95 72.02,38.98 IC3.4
  Bottom 0.254: v58.64,37.92 29.43,37.95 28.91,38.46 OK1.4
N$29
  Top 0.254: OK1.1 20.39,38.98 19.36,37.69 19.36,34.85 14.97,30.46 11.61,30.46 11.61,27.1 10.58,26.07 R36.2
N$30
  Top 0.254: OK1.3 26.07,38.46 25.04,38.46 25.04,37.95 24.52,37.43 24.52,34.59 20.39,30.46 19.36,30.46 19.36,26.85 18.07,25.55 16,25.55 R37.2
N$31
  Bottom 0.254: IC2.10 41.56,35.88 42.59,36.91 67.89,36.91 70.47,34.59 70.47,32.01 67.89,32.01 C13.+
N$32  (via drill 0.61)
  Top 0.254: v51.16,30.44 42.59,30.46 38.98,34.07 IC2.11
  Bottom 0.254: v51.16,30.44 51.62,29.94 66.6,29.94 67.11,29.43 67.37,29.43 | 67.37,29.43 70.99,29.43 72.02,30.46 C13.- | 67.37,29.43 75.89,20.91 84.93,20.91 88.4,17.81 101.6,17.78 101.85,18.03 102.99,18.07 106.61,14.46 138.61,14.46 138.61,4.91 R2.A
N$34
  Bottom 0.254: OK2.2 85.96,27.62 85.96,22.97 104.03,22.97 104.54,23.49 135,23.49 144.04,32.52 146.1,32.52 IC5.1
N$35  (via drill 0.61)
  Top 0.254: v42.63,48.54 34.59,40.53 OK1.6
  Bottom 0.254: v42.63,48.54 62.47,48.53 63.38,49.44 70.47,49.44 70.99,48.92 70.99,45.95 73.57,45.95 74.6,46.98 IC3.10
N$36
  Bottom 0.254: OK1.8 39.49,38.98 59.11,38.98 67.11,46.98 IC3.13
N$37  (via drill 0.61)
  Top 0.254: v99.32,53.92 99.38,52.92 97.06,50.59 97.06,34.59 96.02,34.59 91.12,29.43 OK2.4
  Bottom 0.254: v99.32,53.92 99.9,53.43 116.42,53.43 125.45,44.4 135.52,44.4 138.1,46.98 143,46.98 145.58,44.4 147.91,44.4 148.94,43.62 148.94,41.04 147.91,41.04 IC5.4
N$38
  Bottom 0.254: OK1.16 21.43,48.53 22.46,49.56 29.43,49.56 29.94,49.04 29.94,43.11 43.11,43.11 R1.2
N$39
  Bottom 0.254: 50.99,2.46 52.28,3.75 R24.2 | 50.99,2.46 50.08,1.55 43.62,1.55 42.07,3.1 IC8.1 | 50.99,2.46 109.84,2.46 114.09,6.45 117.97,6.45 122.61,2.06 125.45,2.06 127,3.61 !RESETBUTTON.MP
N$40  (via drill 0.61)
  Top 0.254: v127.52,25.06 138.1,35.62 IC5.13
  Bottom 0.254: v127.52,25.06 116.42,25.04 115.39,26.07 103.51,26.07 101.45,27.88 OK2.8
N$41
  Top 0.254: OK2.6 96.02,29.43 100.93,34.59 101.96,34.59 101.96,41.56 104.8,44.14 117.45,44.14 117.45,35.62 121.58,31.49 130.61,31.49 130.61,34.59 138.61,42.59 IC5.10
N$42
  Top 0.254: OK2.7 98.6,27.62 99.12,27.1 99.12,25.04 R40.2
N$43
  Top 0.254: OK2.5 93.44,27.62 93.96,27.1 93.96,25.04 R39.2
N$44
  Top 0.254: OK1.7 36.4,38.46 35.1,36.91 35.1,34.19 28.13,27.22 28.13,24.52 27.62,24.01 26.07,24.01 26.07,25.04 R42.2
N$45  (via drill 0.61)
  Top 0.254: v27.15,25.06 27.1,34.07 31.49,38.46 OK1.5
  Bottom 0.254: v27.15,25.06 26.07,24.01 21.94,24.01 20.91,25.04 R41.2
N$46
  Top 0.254: OK2.3 88.54,27.62 89.05,27.1 89.05,25.04 R44.2
N$47
  Top 0.254: OK2.1 83.38,27.62 83.89,27.1 83.89,25.04 R43.2
N$48
  Top 0.254: OK1.13 28.91,48.53 28.91,66.08 29.43,66.6 29.43,72.53 T2.1
N$49
  Top 0.762: OK3.5 118.48,45.95 112.54,45.95 112.54,69.44 109.45,72.53 T9.1
N$51
  Top 0.254: OK2.11 95.51,37.43 95.51,49.04 88.02,56.53 88.02,70.99 86.47,72.53 T7.1
N$52
  Top 0.254: OK2.9 100.93,37.43 100.41,37.95 100.41,58.59 98.09,60.92 98.09,72.53 T8.1
N$53
  Top 0.254: OK1.9 38.98,48.53 52.14,61.69 52.14,72.53 T4.1
N$54
  Top 0.254: OK1.11 34.07,48.53 36.91,51.62 36.91,68.92 40.53,72.53 T3.1
N$55  (via drill 0.61)
  Top 0.254: v86.98,67.31 86.99,51.89 90.6,48.53 90.6,37.43 OK2.13
  Bottom 0.254: v86.98,67.31 83.12,71.5 76.41,71.5 75.38,72.53 T6.1
N$56  (via drill 0.61)
  Top 0.254: v85.94,57.07 85.96,37.43 OK2.15
  Bottom 0.254: v85.94,57.07 71.5,71.5 65.05,71.5 64.02,72.53 T5.1
N$58
  Top 0.254: C18.1 18.07,12.91 IC4.5
PUN1  (via drill 0.61)
  Top 0.254: v69.93,28.34 69.95,31.61 68.41,33.16 68.41,37.43 67.11,38.98 IC3.2
  Bottom 0.254: v69.93,28.34 76.41,21.94 105.06,21.94 IC9.19
PUN2  (via drill 0.61)
  Top 0.254: v77.41,36.87 77.44,38.98 IC3.6
  Bottom 0.254: v77.41,36.87 83.89,30.46 104.54,30.46 105.06,29.94 IC9.16
PUN3  (via drill 0.61)
  Top 0.254: v107.85,43.16 107.9,33.56 107.12,32.52 IC9.15
  Bottom 0.254: v107.85,43.16 106.6,44.41 82.85,44.41 80.53,46.98 IC3.8
PUN4
  Bottom 0.254: IC3.12 68.92,46.98 65.83,43.63 65.83,38.46 104.03,38.46 105.06,39.49 IC9.12
PUN5
  Bottom 0.254: IC9.9 114.61,39.49 117.2,36.65 145.33,36.65 146.1,35.88 IC5.2
PUN6  (via drill 0.61)
  Top 0.254: v143.01,34.11 145.07,35.88 145.07,43.88 146.1,44.92 IC5.6
  Bottom 0.254: v143.01,34.11 115.9,34.07 114.61,32.52 IC9.6
PUN7  (via drill 0.61)
  Top 0.254: v124.38,33.06 137.58,45.95 137.58,46.46 138.61,47.5 IC5.8
  Bottom 0.254: v124.38,33.06 122.09,30.46 115.12,30.46 114.61,29.94 IC9.5
PUN8  (via drill 0.61)
  Top 0.254: v122.67,22.44 138.1,37.95 IC5.12
  Bottom 0.254: v122.67,22.44 114.61,22.46 IC9.2
PUNCHDONE  (via drill 0.61)
  Top 0.254: v102.47,17.05 102.99,17.55 102.99,40.01 105.06,42.07 IC9.11 | v105.36,14.16 105.32,11.35 106.09,10.58 PC8E-PUNCH.12
  Bottom 0.254: 103.51,16 v105.36,14.16 | 103.51,16 v102.47,17.05 | 103.51,16 61.95,16 59.63,18.58 38.46,18.58 38.46,16 36.4,13.94 35.67,13.9 R17.2
SOL1
  Top 0.762: C3.2 24.01,67.89 22.97,68.92 22.97,72.53 T1.3
  Bottom 0.762: D1.A 20.91,60.92 20.91,67.11 23.49,67.11 C3.2 | HOLE1.MP 20.91,96.54 21.43,96.02 22.46,96.02 25.04,93.44 25.04,75.38 22.97,75.38 T1.3
SOL2
  Top 0.762: T2.3 34.59,72.53 34.59,68.92 35.62,67.89 C4.2 35.1,67.11 35.1,62.98 33.04,60.92 D3.A
  Bottom 0.762: HOLE2.MP 32.52,96.54 33.04,96.02 34.59,96.02 36.4,93.96 36.4,75.38 34.59,75.38 T2.3
SOL3
  Top 0.762: T3.3 45.95,72.53 45.95,68.92 46.98,67.89 C9.2 46.46,67.11 46.46,63.5 44.4,61.44 D5.A
  Bottom 0.762: HOLE3.MP 43.88,96.54 44.4,96.02 45.43,96.02 48.01,93.44 48.01,75.38 45.95,75.38 T3.3
SOL4
  Top 0.762: T4.3 57.56,72.53 57.56,68.41 58.08,67.89 C10.2 58.08,67.11 58.08,63.5 56.53,61.95 D7.A
  Bottom 0.762: HOLE4.MP 55.5,96.54 56.01,96.02 57.05,96.02 59.63,93.44 59.63,75.38 57.56,75.38 T4.3
SOL5
  Top 0.762: T5.3 68.92,72.53 68.92,68.41 69.44,67.89 C11.2 69.44,67.11 69.44,62.98 68.41,61.95 D9.A
  Bottom 0.762: HOLE5.MP 67.11,96.54 67.37,96.02 68.41,96.02 70.99,93.44 70.99,75.38 68.92,75.38 T5.3
SOL6
  Top 0.762: T6.3 80.54,72.53 80.54,68.41 81.05,67.89 C12.2 80.54,67.11 80.54,63.5 78.47,61.44 D11.A
  Bottom 0.762: HOLE6.MP 78.47,97.06 82.6,92.93 82.6,75.38 80.02,75.38 T6.3
SOL7
  Top 0.762: T7.3 91.9,72.53 91.9,68.41 92.41,67.89 C7.2 91.9,67.11 91.9,62.47 91.12,61.44 D13.A
  Bottom 0.762: HOLE7.MP 89.57,96.54 90.09,96.02 91.12,96.02 93.7,93.19 93.7,75.38 91.38,75.38 T7.3
SOL8
  Top 0.762: T8.3 102.99,72.53 102.99,68.92 104.03,67.89 C8.2 103.51,67.11 103.51,61.95 102.99,61.44 D15.A
  Bottom 0.762: HOLE8.MP 100.93,96.54 101.45,96.02 102.48,96.02 105.06,93.44 105.06,75.38 102.99,75.38 T8.3
SOLENBL  (via drill 0.61)
  Top 0.254: 76.41,43.11 76.92,43.62 76.92,46.98 IC3.9 | 76.41,43.11 75.11,41.56 IC3.5 | 74.08,45.43 76.41,43.11 | 74.08,45.43 72.53,46.98 IC3.11 | v26.11,32.01 23.49,29.43 IC1.6 | v69.41,34.33 69.44,38.98 IC3.3 69.95,41.56 74.08,45.43
  Bottom 0.254: 141.97,42.07 142.49,42.59 | 141.97,42.07 140.42,40.53 IC5.11 138.1,40.53 136.55,42.07 115.39,42.07 114.61,41.04 104.52,41.04 102.62,39.12 83.99,39.14 81.05,42.07 75.38,42.07 75.11,41.56 IC3.5 | 142.49,42.59 146.1,42.59 IC5.5 | 141.97,42.07 142.49,42.07 146.1,38.46 IC5.3 | 142.49,42.59 139.91,44.92 IC5.9 | v26.11,32.01 27.1,33.04 50.8,33.02 52.07,34.33 v69.41,34.33
SOLHOLE
  Top 0.762: T9.3 114.61,72.53 114.61,69.44 115.9,67.89 C6.2 115.39,67.11 115.39,60.92 D19.A
  Bottom 0.762: SPRKT/FEED.MP 115.39,96.02 116.93,94.48 116.93,75.38 114.61,75.38 T9.3
SYNC
  Bottom 0.254: IC4.3 26.59,10.07 40.01,10.07 42.59,7.49 82.08,7.49 82.85,6.72 99.64,6.72 101.71,8.78 110.74,8.78 111.51,9.55 PC8E-PUNCH.8
VCC  (via drill 0.61)
  Top 0.762: R21.S 141.97,9.03 136.55,9.03 R2.S 136.03,10.07 138.1,11.88 138.1,15.49 R2.E 138.88,17.55 138.88,21.94 139.19,22.23 | 145.04,21.59 145.07,17.55 R21.E | 145.04,21.59 145.03,21.97 | C14.1 141.46,52.92 141.48,32.26 | +5VDC.MP 140.94,96.02 142.49,94.48 142.49,55.5 140.94,53.95 C14.1 | IC1.14 10.07,35.1 5.94,30.98 5.94,30.46 C16.1 | C5.1 14.68,3.39 | 14.68,3.39 16.52,4.91 IC4.8 | 14.68,3.39 11.88,5.94 R10.1 11.88,6.45 12.91,7.49 12.91,20.39 | 12.91,20.39 14.46,20.39 R37.1 16,20.39 19.88,20.39 R41.1 | 12.91,20.39 10.58,20.39 R36.1 | 89.05,19.62 84.93,19.62 R43.1 | 89.05,19.62 93.33,19.62 R39.1 | v87.02,40.27 87.01,45.42 88.54,46.98 R11.1 | R1.1 44.92,46.98 49.04,46.98 R3.1 | IC8.2 44.4,4.39 45.95,5.94 48.53,5.94 48.53,4.39 IC8.4 | IC7.11 IC7.10 50.08,21.94 50.08,20.91 52.92,20.91 56.27,17.81 | 43.63,17.81 44.4,18.58 44.4,21.94 IC7.12 | 43.63,17.81 42.59,16.52 IC7.2 | IC7.14 40.01,21.94 43.62,18.58 43.62,18.07 43.63,17.81 | 56.27,17.81 56.53,17.55 56.53,6.45 58.08,4.91 R24.1 | 56.53,37.95 56.53,18.07 56.27,17.81 | 56.53,37.95 56.53,43.88 54.47,45.95 R5.1 | v67.83,43.83 65.05,46.98 IC3.14 | 56.53,37.95 61.69,32.79 61.69,24.78 67.37,19.1 C15.1 | 145.04,21.59 144.78,21.59 144.78,21.97 | C14.1 140.97,34.29 139.7,33.02 IC5.14 | 89.05,19.62 R44.1
  Bottom 0.762: R23.1 117.45,27.1 120.03,29.43 134.49,29.43 138.1,33.04 IC5.14 | IC2.14 30.46,34.07 11.61,34.07 10.58,35.1 IC1.14 | C16.1 5.94,29.94 5.94,20.91 10.07,20.91 R36.1 | C15.1 68.41,19.1 83.89,19.1 R43.1 | IC3.14 64.02,46.98 59.89,46.98 R7.1 R5.1 53.95,46.98 50.16,46.98 | 50.16,46.98 50.08,46.98 | R24.1 58.08,4.91 56.53,6.45 51.62,6.45 49.56,4.39 IC8.4 | IC7.12 IC7.11 | v67.83,43.83 82.09,43.88 82.11,43.87 R9.1 84.39,40.52 84.69,40.33 v87.02,40.27 92.41,40.33 93.06,40.31 R13.1 | IC7.14 38.98,21.94 27.62,21.94 26.07,20.39 R42.1 R41.1 | 107.49,19.2 107.12,19.62 IC9.20 104.8,19.62 99.64,19.62 R40.1 | 107.49,19.2 107.76,18.89 108.93,17.55 138.1,17.55 R2.E | R3.1 50.16,46.98 | 99.06,46.99 98.04,46.23 97.12,45.43 90.6,45.44 89.06,46.98 R11.1 | 99.06,46.99 99.38,46.98 105.57,46.98 R19.1 | R44.1 107.44,19.05 107.49,19.2 | 99.06,46.99 R15.1
  pour Top: 139.25,32.25 138.75,31.75 138.69,22.73 139.44,21.98 146.28,21.97 147.25,23 147.25,31.25 141.75,31.25 141.73,32.26
  pour Top: 142.5,87.75 156.25,87.75 156.25,37.25 153.5,37.25 153.5,25 148,25 148,31.25 150,31.25 150,50.25 139.59,50.25 139.57,54.74 142.49,54.92

### Text on the board
tPlace: Rev. A (C) 2005 CEMorris | Tally Tape Punch Interface for PDP-8 | FEED PW 12.2 mS | PUNCH PW 4.5 mS
tNames: SE13 | SE13 | +5VDC | GND | A17,5mm | A17,5mm | A17,5mm | A17,5mm | A17,5mm | A17,5mm | A17,5mm | A17,5mm | T1 | T2 | T3 | T4 | T5 | T6 | T7 | T8 | TIP122 | TIP122 | TIP122 | TIP122 | TIP122 | TIP122 | TIP122 | TIP122 | D5 | 1N4942 | D7 | 1N4942 | D9 | 1N4942 | D11 | 1N4942 | D13 | 1N4942 | D15 | 1N4942 | D1 | 1N4942 | D3 | 1N4942 | C14 | 0.1 | 1 | 1 | 40 | NE555N | IC4